# Altium schematic sheet Sch_mcu_brd_sensors.SchDoc
size A
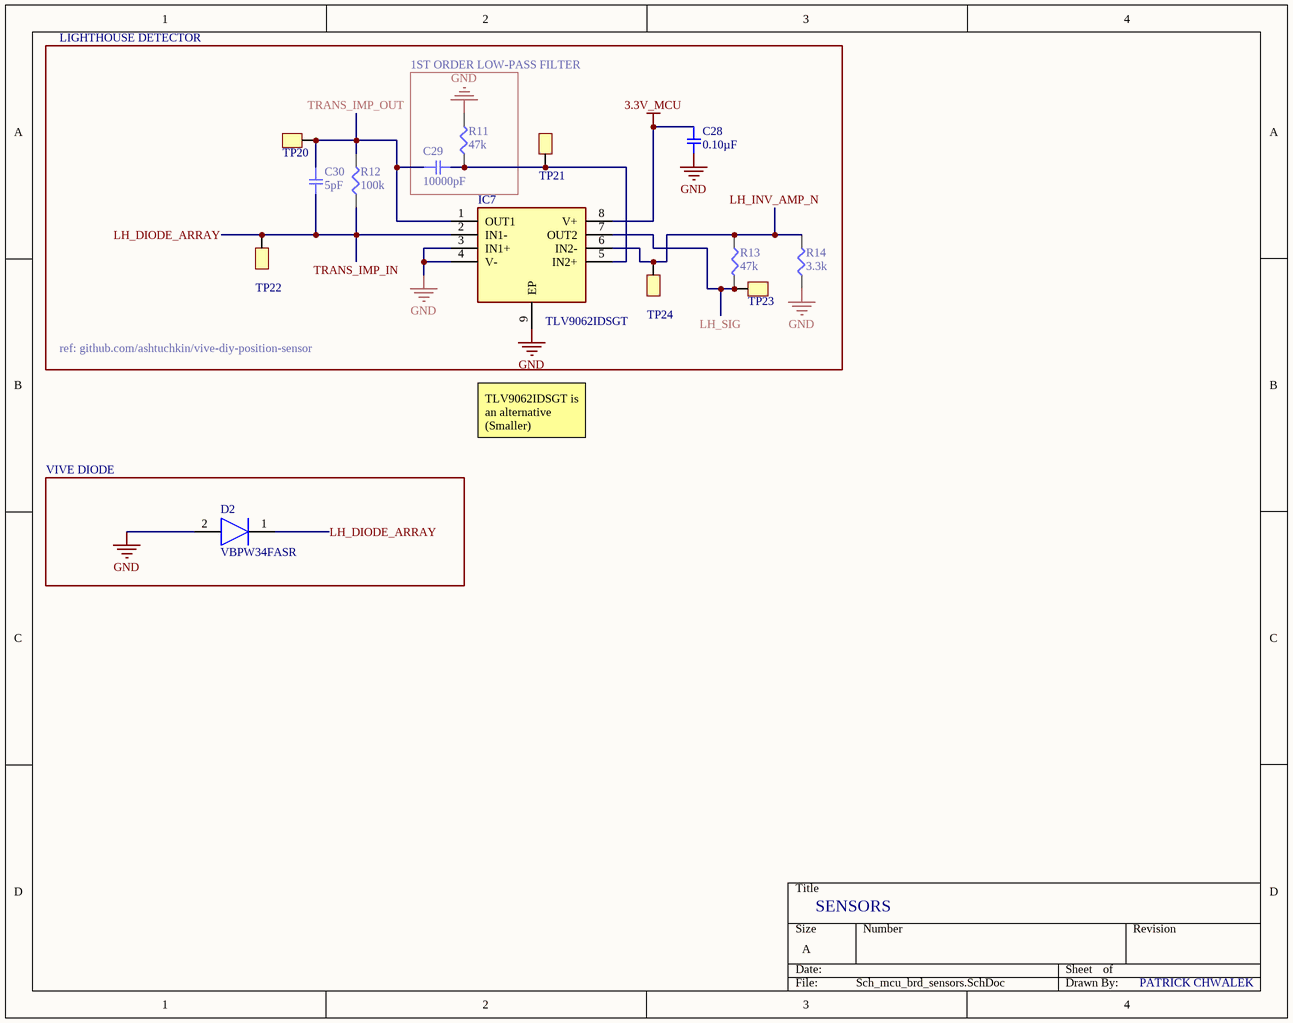
[diagram p0: Sch_mcu_brd_sensors.SchDoc]

## Parts
C28  0.10µF  [SMD-0402C]
C29  10000pF  [SMD-0402C]
C30  5pF  [SMD-0402C]
D2  VBPW34FASR  [VBPW34FASR]
IC7  TLV9062IDSGT  [SON50P200X200X80-9N]
R11  47k  [SMD-0402-RES]
R12  100k  [SMD-0402-RES]
R13  47k  [SMD-0402-RES]
R14  3.3k  [SMD-0402-RES]
TP20  TestPoint  [TestPoint_0.4mm]  (value not drawn)
TP21  TestPoint  [TestPoint_0.4mm]  (value not drawn)
TP22  TestPoint  [TestPoint_0.4mm]  (value not drawn)
TP23  TestPoint  [TestPoint_0.4mm]  (value not drawn)
TP24  TestPoint  [TestPoint_0.4mm]  (value not drawn)

## Blocks framed on the sheet
1ST ORDER LOW-PASS FILTER: C29 R11
VIVE DIODE: D2

## Nets
3.3V_MCU: C28.1 IC7.8(V+)
GND: C28.2 D2.2(K) IC7.3(IN1+) IC7.4(V-) IC7.9(EP) R11.2 R14.1
LH_DIODE_ARRAY: C30.2 D2.1(A) IC7.2(IN1-) R12.1 TP22.1  [also labelled TRANS_IMP_IN]
LH_INV_AMP_N: IC7.6(IN2-) R13.1 R14.2 TP24.1
LH_SIG: IC7.7(OUT2) R13.2 TP23.1
TRANS_IMP_OUT: C29.1 C30.1 IC7.1(OUT1) R12.2 TP20.1
NetC29_2: C29.2 IC7.5(IN2+) R11.1 TP21.1

## Notes on the sheet
- LIGHTHOUSE DETECTOR
- ref: github.com/ashtuchkin/vive-diy-position-sensor
- TLV9062IDSGT is an alternative (Smaller)
- SENSORS
- PATRICK CHWALEK

## Library data of the parts
C28 = GCM155R71C104KA55D: CAP CER 0.1UF 16V X7R 0402; Manufacturer: Murata Electronics North America; Factory Stock: 0; Unit Price (USD): 0.1; Minimum Quantity: 1; Tolerance: ±10%; Datasheets: http://www.murata.com/~/media/webrenewal/support/library/catalog/products/capacitor/mlcc/c03e.ashx; Image: //media.digikey.com/Renders/Murata%20Renders/ZRB-SERIES-0402.jpg; Digi-Key Part Number: 490-4759-1-ND; Part Number: GCM155R71C104KA55D; Quantity Available: 734194; @ qty: 0; Packaging: Cut Tape (CT); Series: GCM; Part Status: Active; Value: 0.10µF; Voltage: 16V; Temperature Coefficient: X7R; Operating Temperature: -55°C ~ 125°C; Features: -; Ratings: AEC-Q200; Applications: Automotive; Mounting Type: Surface Mount, MLCC; Package / Case: 0402 (1005 Metric); Size / Dimension: 0.039" L x 0.020" W (1.00mm x 0.50mm); Height - Seated (Max): -; Thickness (Max): 0.022" (0.55mm); Lead Spacing: -; Lead Style: -
C29 = GCM155R71H103KA55D: CAP CER 10000PF 50V X7R 0402; Manufacturer: Murata Electronics North America; Factory Stock: 0; Unit Price (USD): 0.1; Minimum Quantity: 1; Tolerance: ±10%; Datasheets: http://www.murata.com/~/media/webrenewal/support/library/catalog/products/capacitor/mlcc/c03e.ashx; Image: //media.digikey.com/Renders/Murata%20Renders/ZRB-SERIES-0402.jpg; Digi-Key Part Number: 490-4762-1-ND; Part Number: GCM155R71H103KA55D; Quantity Available: 650067; @ qty: 0; Packaging: Cut Tape (CT); Series: GCM; Part Status: Active; Value: 10000pF; Voltage: 50V; Temperature Coefficient: X7R; Operating Temperature: -55°C ~ 125°C; Features: -; Ratings: AEC-Q200; Applications: Automotive; Mounting Type: Surface Mount, MLCC; Package / Case: 0402 (1005 Metric); Size / Dimension: 0.039" L x 0.020" W (1.00mm x 0.50mm); Height - Seated (Max): -; Thickness (Max): 0.022" (0.55mm); Lead Spacing: -; Lead Style: -
C30 = GJM1555C1H5R0BB01D: CAP CER 5PF 50V NP0 0402; Manufacturer: Murata Electronics North America; Factory Stock: 0; Unit Price (USD): 0.2; Minimum Quantity: 1; Tolerance: ±0.1pF; Temperature Coefficient: C0G, NP0; Datasheets: http://www.murata.com/~/media/webrenewal/support/library/catalog/products/capacitor/mlcc/c02e.pdf; Image: //media.digikey.com/Renders/Murata%20Renders/ZRB-SERIES-0402.jpg; Digi-Key Part Number: 490-8103-1-ND; Part Number: GJM1555C1H5R0BB01D; Quantity Available: 17055; @ qty: 0; Packaging: Cut Tape (CT); Series: GJM; Part Status: Active; Value: 5pF; Voltage: 50V; Operating Temperature: -55°C ~ 125°C; Features: High Q, Low Loss; Ratings: -; Applications: RF, Microwave, High Frequency; Mounting Type: Surface Mount, MLCC; Package / Case: 0402 (1005 Metric); Size / Dimension: 0.039" L x 0.020" W (1.00mm x 0.50mm); Height - Seated (Max): -; Thickness (Max): 0.022" (0.55mm); Lead Spacing: -; Lead Style: -
D2 = VBPW34FASR: Diode; Manufacturer_Name: Vishay; Datasheet Link: https://www.vishay.com/docs/81127/vbpw34fa.pdf; Height: 1.3mm; Manufacturer_Part_Number: VBPW34FASR; Mouser Part Number: 782-VBPW34FASR; Mouser Price/Stock: https://www.mouser.com/Search/Refine.aspx?Keyword=782-VBPW34FASR; RS Part Number: 7689401; RS Price/Stock: https://uk.rs-online.com/web/p/products/7689401
IC7 = TLV9062IDSGT: Integrated Circuit; Manufacturer_Name: Texas Instruments; Datasheet Link: http://www.ti.com/lit/gpn/TLV9062; Height: 0.8mm; Manufacturer_Part_Number: TLV9062IDSGT; Mouser Part Number: 595-TLV9062IDSGT; Mouser Price/Stock: https://www.mouser.com/Search/Refine.aspx?Keyword=595-TLV9062IDSGT
R11 R13 = ERJ-2GEJ473X: RES SMD 47K OHM 5% 1/10W 0402; Manufacturer: Panasonic Electronic Components; Factory Stock: 0; Unit Price (USD): 0.00350; @ qty: 1500; Minimum Quantity: 1; Power (Watts): 0.1W, 1/10W; Temperature Coefficient: ±200ppm/°C; Part Number: ERJ-2GEJ473X; Datasheets: http://industrial.panasonic.com/www-cgi/jvcr13pz.cgi?E+PZ+3+AOA0001+ERJ2GEJ473X+7+WW; Image: //media.digikey.com/Photos/Panasonic%20Photos/ERJ-PA2-Series.jpg; Digi-Key Part Number: P47KJCT-ND; Quantity Available: 5182645; Packaging: Cut Tape (CT); Series: ERJ; Part Status: Active; Value: 47k; Tolerance: ±5%; Composition: Thick Film; Features: Automotive AEC-Q200; Operating Temperature: -55°C ~ 155°C; Package / Case: 0402 (1005 Metric); Supplier Device Package: 0402; Size / Dimension: 0.039" L x 0.020" W (1.00mm x 0.50mm); Height - Seated (Max): 0.016" (0.40mm); Number of Terminations: 2; Failure Rate: -
R12 = ERJ-2GEJ104X: RES SMD 100K OHM 5% 1/10W 0402; Manufacturer: Panasonic Electronic Components; Factory Stock: 0; Unit Price (USD): 0.00350; @ qty: 1500; Minimum Quantity: 1; Power (Watts): 0.1W, 1/10W; Temperature Coefficient: ±200ppm/°C; Part Number: ERJ-2GEJ104X; Datasheets: http://industrial.panasonic.com/www-cgi/jvcr13pz.cgi?E+PZ+3+AOA0001+ERJ2GEJ104X+7+WW; Image: //media.digikey.com/Photos/Panasonic%20Photos/ERJ-PA2-Series.jpg; Digi-Key Part Number: P100KJCT-ND; Quantity Available: 2387986; Packaging: Cut Tape (CT); Series: ERJ; Part Status: Active; Value: 100k; Tolerance: ±5%; Composition: Thick Film; Features: Automotive AEC-Q200; Operating Temperature: -55°C ~ 155°C; Package / Case: 0402 (1005 Metric); Supplier Device Package: 0402; Size / Dimension: 0.039" L x 0.020" W (1.00mm x 0.50mm); Height - Seated (Max): 0.016" (0.40mm); Number of Terminations: 2; Failure Rate: -
R14 = ERJ-2GEJ332X: RES SMD 3.3K OHM 5% 1/10W 0402; Manufacturer: Panasonic Electronic Components; Factory Stock: 0; Unit Price (USD): 0.00350; @ qty: 1500; Minimum Quantity: 1; Power (Watts): 0.1W, 1/10W; Temperature Coefficient: ±200ppm/°C; Part Number: ERJ-2GEJ332X; Datasheets: http://industrial.panasonic.com/www-cgi/jvcr13pz.cgi?E+PZ+3+AOA0001+ERJ2GEJ332X+7+WW; Image: //media.digikey.com/Photos/Panasonic%20Photos/ERJ-PA2-Series.jpg; Digi-Key Part Number: P3.3KJCT-ND; Quantity Available: 514266; Packaging: Cut Tape (CT); Series: ERJ; Part Status: Active; Value: 3.3k; Tolerance: ±5%; Composition: Thick Film; Features: Automotive AEC-Q200; Operating Temperature: -55°C ~ 155°C; Package / Case: 0402 (1005 Metric); Supplier Device Package: 0402; Size / Dimension: 0.039" L x 0.020" W (1.00mm x 0.50mm); Height - Seated (Max): 0.016" (0.40mm); Number of Terminations: 2; Failure Rate: -